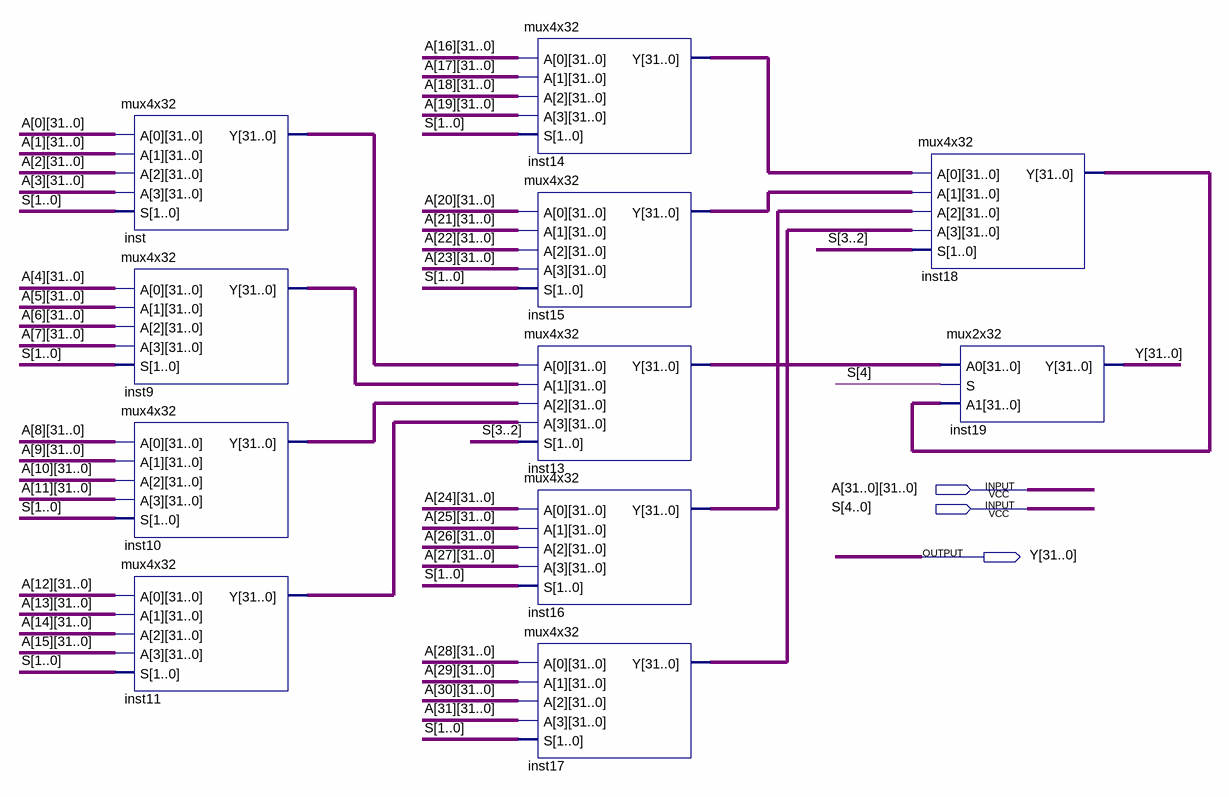
[diagram p0: schematic sheet]
// Quartus schematic mux32x32.bdf as structural Verilog: 11 symbols, 3 pins
module mux32x32 (
  input  [31:0] A_31,
  input  [31:0] A_30,
  input  [31:0] A_29,
  input  [31:0] A_28,
  input  [31:0] A_27,
  input  [31:0] A_26,
  input  [31:0] A_25,
  input  [31:0] A_24,
  input  [31:0] A_23,
  input  [31:0] A_22,
  input  [31:0] A_21,
  input  [31:0] A_20,
  input  [31:0] A_19,
  input  [31:0] A_18,
  input  [31:0] A_17,
  input  [31:0] A_16,
  input  [31:0] A_15,
  input  [31:0] A_14,
  input  [31:0] A_13,
  input  [31:0] A_12,
  input  [31:0] A_11,
  input  [31:0] A_10,
  input  [31:0] A_9,
  input  [31:0] A_8,
  input  [31:0] A_7,
  input  [31:0] A_6,
  input  [31:0] A_5,
  input  [31:0] A_4,
  input  [31:0] A_3,
  input  [31:0] A_2,
  input  [31:0] A_1,
  input  [31:0] A_0,
  input  [4:0] S,
  output [31:0] Y
);

  wire [31:0] inst9_y, inst10_y, inst11_y, inst13_y, inst14_y, inst15_y, inst16_y, inst17_y, inst18_y, inst_y;

  mux4x32 inst (.A_0(A_0), .A_1(A_1), .A_2(A_2), .A_3(A_3), .S(S[1:0]), .Y(inst_y));
  mux4x32 inst9 (.A_0(A_4), .A_1(A_5), .A_2(A_6), .A_3(A_7), .S(S[1:0]), .Y(inst9_y));
  mux4x32 inst10 (.A_0(A_8), .A_1(A_9), .A_2(A_10), .A_3(A_11), .S(S[1:0]), .Y(inst10_y));
  mux4x32 inst11 (.A_0(A_12), .A_1(A_13), .A_2(A_14), .A_3(A_15), .S(S[1:0]), .Y(inst11_y));
  mux4x32 inst14 (.A_0(A_16), .A_1(A_17), .A_2(A_18), .A_3(A_19), .S(S[1:0]), .Y(inst14_y));
  mux4x32 inst15 (.A_0(A_20), .A_1(A_21), .A_2(A_22), .A_3(A_23), .S(S[1:0]), .Y(inst15_y));
  mux4x32 inst13 (.A_0(inst_y), .A_1(inst9_y), .A_2(inst10_y), .A_3(inst11_y), .S(S[3:2]), .Y(inst13_y));
  mux4x32 inst16 (.A_0(A_24), .A_1(A_25), .A_2(A_26), .A_3(A_27), .S(S[1:0]), .Y(inst16_y));
  mux4x32 inst17 (.A_0(A_28), .A_1(A_29), .A_2(A_30), .A_3(A_31), .S(S[1:0]), .Y(inst17_y));
  mux4x32 inst18 (.A_0(inst14_y), .A_1(inst15_y), .A_2(inst16_y), .A_3(inst17_y), .S(S[3:2]), .Y(inst18_y));
  mux2x32 inst19 (.A0(inst13_y), .S(S[4]), .A1(inst18_y), .Y(Y));
endmodule
